# Altium project GNSS_MB.PrjPcb
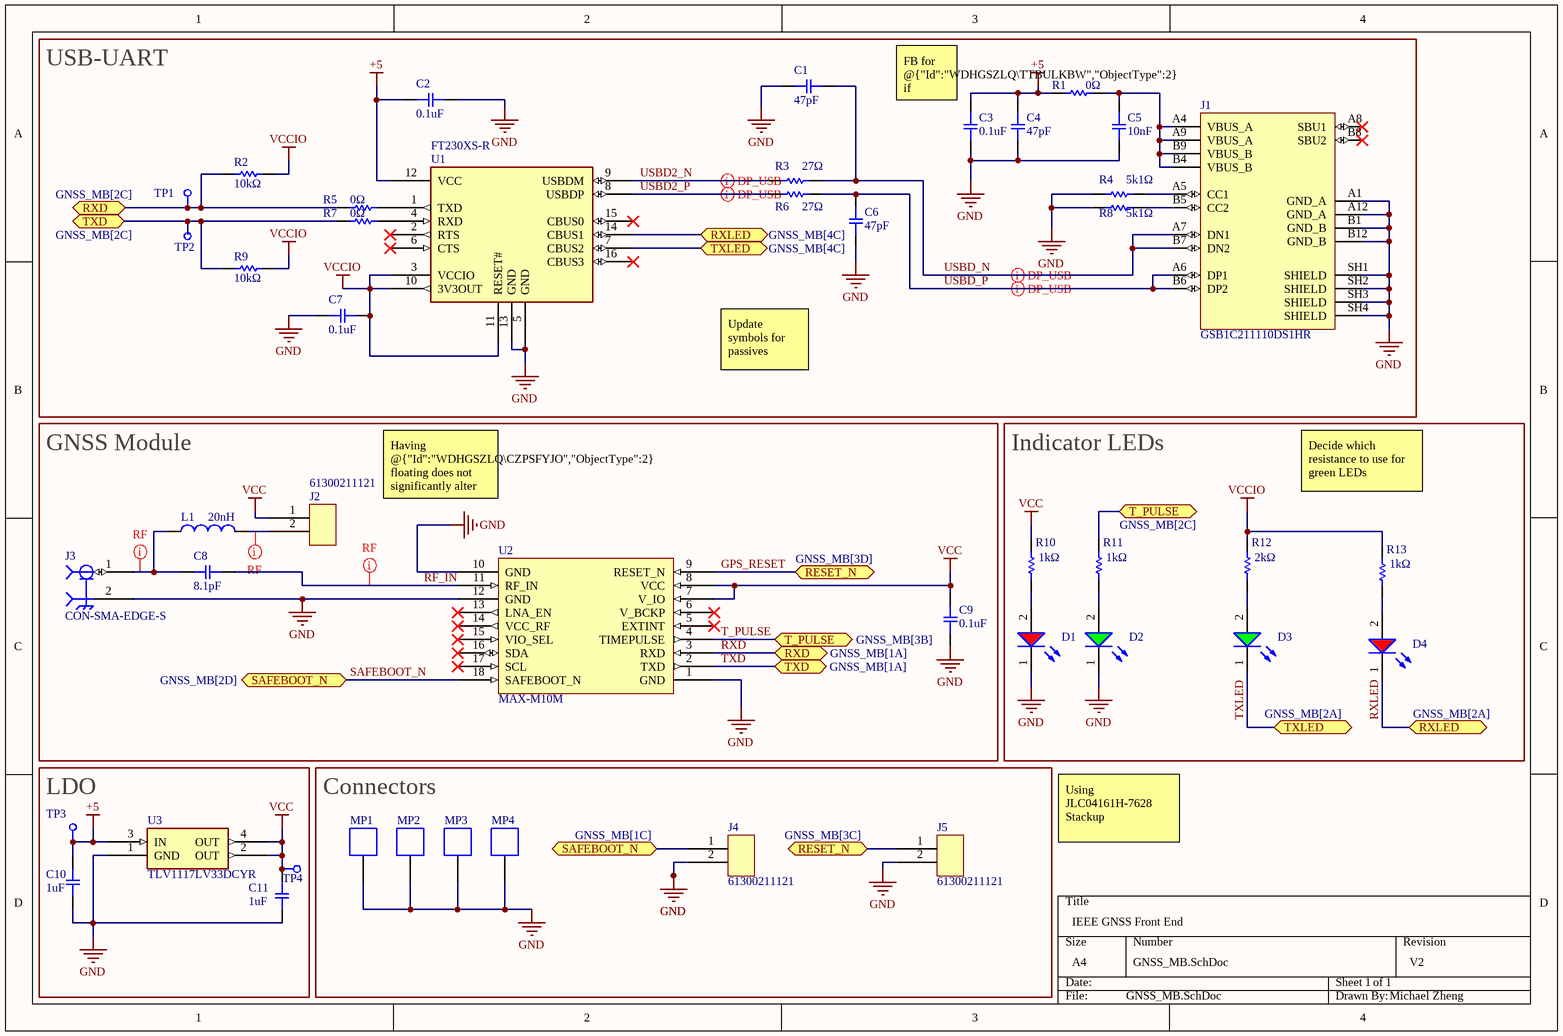
[diagram p0: GNSS_MB.SchDoc]
Author: Michael Zheng; Revision: V2; Title: IEEE GNSS Front End
1 sheet, 45 parts. Net scope: flat (ports and power ports of the same name join across sheets).
Board file: GNSS_MB.PcbDoc

## Sheet GNSS_MB.SchDoc: IEEE GNSS Front End
size A4; SheetNumber: 1; SheetTotal: 1

### Parts
C1  Capacitance: 47pF  [CAP_MURATA_0603]  (hidden comment: GCM1885C2A470JA16D)
C2  Capacitance: 0.1uF  [CAP_MURATA_0603]  (hidden comment: GCM188L81H104KA57D)
C3  Capacitance: 0.1uF  [CAP_MURATA_0603]  (hidden comment: GCM188L81H104KA57D)
C4  Capacitance: 47pF  [CAP_MURATA_0603]  (hidden comment: GCM1885C2A470JA16D)
C5  Capacitance: 10nF  [CAP_MURATA_0603]  (hidden comment: GCM188R72A103KA37D)
C6  Capacitance: 47pF  [CAP_MURATA_0603]  (hidden comment: GCM1885C2A470JA16D)
C7  Capacitance: 0.1uF  [CAP_MURATA_0603]  (hidden comment: GCM188L81H104KA57D)
C8  Capacitance: 8.1pF  [0402_CAP]  (hidden comment: GJM1555C1H8R1BB01D)
C9  Capacitance: 0.1uF  [CAP_MURATA_0603]  (hidden comment: GCM188L81H104KA57D)
C10  Capacitance: 1uF  [CAP_MURATA_0603]  (hidden comment: GRM188R61A105KA61D)
C11  Capacitance: 1uF  [CAP_MURATA_0603]  (hidden comment: GRM188R61A105KA61D)
D1  Red, 2V, 140°  [WL-SMCW]  (value not drawn)
D2  Green, 3.2V, 140°  [WL-SMCW]  (value not drawn)
D3  Green, 3.2V, 140°  [WL-SMCW]  (value not drawn)
D4  Red, 2V, 140°  [WL-SMCW]  (value not drawn)
J1  GSB1C211110DS1HR  [AMPHENOL_GSB1C211110DS1HR]
J2  61300211121  [61300211121]
J3  CON-SMA-EDGE-S  [RFSOLUTIONS_CON-SMA-EDGE-S]
J4  61300211121  [61300211121]
J5  61300211121  [61300211121]
L1  value 20nH  [INDC1006X60N]  (hidden comment: LQW15AN20NG8ZD)
MP1  36900000  [36900000]  (value not drawn)
MP2  36900000  [36900000]  (value not drawn)
MP3  36900000  [36900000]  (value not drawn)
MP4  36900000  [36900000]  (value not drawn)
R1  Resistance: 0Ω  [RC0603JR-070RL]  (hidden comment: RC0603JR-070RL)
R2  Resistance: 10kΩ  [RC0603JR-070RL]  (hidden comment: RC0603FR-0710KL)
R3  Resistance: 27Ω  [RC0603JR-070RL]  (hidden comment: RC0603FR-0727RL)
R4  Resistance: 5k1Ω  [RC0603JR-070RL]  (hidden comment: RC0603FR-075K1L)
R5  Resistance: 0Ω  [RC0603JR-070RL]  (hidden comment: RC0603JR-070RL)
R6  Resistance: 27Ω  [RC0603JR-070RL]  (hidden comment: RC0603FR-0727RL)
R7  Resistance: 0Ω  [RC0603JR-070RL]  (hidden comment: RC0603JR-070RL)
R8  Resistance: 5k1Ω  [RC0603JR-070RL]  (hidden comment: RC0603FR-075K1L)
R9  Resistance: 10kΩ  [RC0603JR-070RL]  (hidden comment: RC0603FR-0710KL)
R10  Resistance: 1kΩ  [RC0603JR-070RL]  (hidden comment: RC0603FR-071KL)
R11  Resistance: 1kΩ  [RC0603JR-070RL]  (hidden comment: RC0603FR-071KL)
R12  Resistance: 2kΩ  [RC0603JR-070RL]  (hidden comment: RC0603JR-072KL)
R13  Resistance: 1kΩ  [RC0603JR-070RL]  (hidden comment: RC0603FR-071KL)
TP1  TEST_POINT  [TEST_POINT]  (value not drawn)
TP2  TEST_POINT  [TEST_POINT]  (value not drawn)
TP3  TEST_POINT  [TEST_POINT]  (value not drawn)
TP4  TEST_POINT  [TEST_POINT]  (value not drawn)
U1  FT230XS-R  [FT230XS-R]
U2  MAX-M10M  [MAX-M10M]
U3  TLV1117LV33DCYR  [TLV1117LV33DCYR]

### Blocks framed on the sheet
USB-UART: C1-C7 J1 R1-R9 TP1 TP2 U1
GNSS Module: C8 C9 J2 J3 L1 U2
Indicator LEDs: D1-D4 R10-R13
LDO: C10 C11 TP3 TP4 U3
Connectors: J4 J5 MP1-MP4

### Ports
RESET_N (bidir, see GNSS_MB[3C]), RESET_N (bidir, see GNSS_MB[3D]), RXD (bidir, see GNSS_MB[1A]), RXD (bidir, see GNSS_MB[2C]), RXLED (bidir, see GNSS_MB[2A]), RXLED (bidir, see GNSS_MB[4C]), SAFEBOOT_N (bidir, see GNSS_MB[1C]), SAFEBOOT_N (bidir, see GNSS_MB[2D]), T_PULSE (bidir, see GNSS_MB[2C]), T_PULSE (bidir, see GNSS_MB[3B]), TXD (bidir, see GNSS_MB[1A]), TXD (bidir, see GNSS_MB[2C]), TXLED (bidir, see GNSS_MB[2A]), TXLED (bidir, see GNSS_MB[4C])

### Nets
+5: C2.2 C3.1 C4.1 C10.2 R1.1 TP3.1 U1.12(VCC) U3.3(IN)
GND: C1.1 C2.1 C3.2 C4.2 C5.2 C6.2 C7.2 C9.1 C10.1 C11.1 D1.1(K) D2.1(K) J1.A1(GND_A) J1.A12(GND_A) J1.B1(GND_B) J1.B12(GND_B) J1.SH1(SHIELD) J1.SH2(SHIELD) J1.SH3(SHIELD) J1.SH4(SHIELD) J3.2(GND) J4.2 J5.2 MP1.1 MP2.1 MP3.1 MP4.1 R4.1 R8.1 U1.5(GND) U1.13(GND) U2.1(GND) U2.10(GND) U2.12(GND) U3.1(GND)
VCC: C9.2 C11.2 J2.1 R10.2 TP4.1 U2.7(V_IO) U2.8(VCC) U3.2(OUT) U3.4(OUT)
VCCIO: C7.1 R2.2 R9.2 R12.2 R13.2 U1.3(VCCIO) U1.10(3V3OUT) U1.11(RESET#)
GPS_RESET: J5.1 U2.9(RESET_N) ; port RESET_N
RF_IN: C8.2 U2.11(RF_IN)
RXD: R2.1 R5.1 TP1.1 U2.3(RXD) ; port RXD
RXLED: D4.1(K) U1.14(CBUS1) ; port RXLED
SAFEBOOT_N: J4.1 U2.18(SAFEBOOT_N) ; port SAFEBOOT_N
T_PULSE: R11.2 U2.4(TIMEPULSE) ; port T_PULSE
TXD: R7.1 R9.1 TP2.1 U2.2(TXD) ; port TXD
TXLED: D3.1(K) U1.7(CBUS2) ; port TXLED
USBD2_N: R3.1 U1.9(USBDM)
USBD2_P: R6.1 U1.8(USBDP)
USBD_N: C1.2 J1.A7(DN1) J1.B7(DN2) R3.2
USBD_P: C6.1 J1.A6(DP1) J1.B6(DP2) R6.2
NetC5_1: C5.1 J1.A4(VBUS_A) J1.A9(VBUS_A) J1.B4(VBUS_B) J1.B9(VBUS_B) R1.2
NetC8_1: C8.1 J3.1(RF) L1.1
NetD1_2: D1.2(A) R10.1
NetD2_2: D2.2(A) R11.1
NetD3_2: D3.2(A) R12.1
NetD4_2: D4.2(A) R13.1
NetJ1_A5: J1.A5(CC1) R4.2
NetJ1_B5: J1.B5(CC2) R8.2
NetJ2_2: J2.2 L1.2
NetR5_2: R5.2 U1.1(TXD)
NetR7_2: R7.2 U1.4(RXD)

Not connected (* = marked no-connect by the designer): J1 A8(SBU1)* B8(SBU2)*; U1 2(RTS)* 6(CTS)* 15(CBUS0)* 16(CBUS3)*; U2 5(EXTINT)* 6(V_BCKP)* 13(LNA_EN)* 14(VCC_RF)* 15(VIO_SEL)* 16(SDA)* 17(SCL)*

### Layout directives
differential pair; differential pair class USB: USBD2_N, USBD2_P, USBD_N, USBD_P
net class RF: NetC8_1, NetJ2_2, RF_IN

### Notes on the sheet
- (near C3) FB for @{"Id":"WDHGSZLQ\TTBULKBW","ObjectType":2} if required
- Update symbols for passives
- Having @{"Id":"WDHGSZLQ\CZPSFYJO","ObjectType":2} floating does not significantly alter matching
- Decide which resistance to use for green LEDs
- Using JLC04161H-7628 Stackup

### Library data of the parts
C1 C4 C6 = GCM188L81H104KA57D: CAP CER 47PF 100V C0G/NP0 0603
C2 C3 C7 C9 = GCM188L81H104KA57D: CAP CER 0.1UF 50V X8L 0603
C5 = GCM188L81H104KA57D: CAP CER 10000PF 100V X7R 0603
C8 = GRM1555C1H102JA01D: CAP CER 8.1PF 50V C0G/NP0 0402
C10 C11 = GRM188R61A105KA61D: CAP CER 1UF 10V X5R 0603
D1 D4 = 150060RS75000: WL-SMCW Mono-color Chip LED Waterclear, SMT, size 0603, Red, 2V, 140°; Manufacturer: Wurth Elektronik; Case/Size Code: 0603; Chip Technology: AlInGaP; Dominant Wavelength: 625nm; Luminous Intensity: 250mcd; Peak Wavelength: 630nm; Manufacturer Part Number: 150060RS75000; Category: Signal LEDs; Match Code: WL-SMCW; ComponentLink1Description: Website Link; ComponentLink1URL: https://www.we-online.com/redexpert/article/150060RS75000?ad; ComponentLink2Description: Datasheet Link; ComponentLink2URL: https://www.we-online.com/redexpert/spec/150060RS75000?ad; Mount: Surface Mount; Operating Temperature Max: 85°C; Operating Temperature Min: -40°C; Packaging: Tape and Reel; Length: 1.6mm; Width: 0.8mm; Height: 0.7mm; Emitting Color: Red; Forward Voltage: 2V; Viewing Angle: 140°
D2 D3 = 150060GS75000: WL-SMCW Mono-color Chip LED Waterclear, SMT, size 0603, Green, 3.2V, 140°; Manufacturer: Wurth Elektronik; Case/Size Code: 0603; Chip Technology: InGaN; Dominant Wavelength: 525nm; Luminous Intensity: 430mcd; Peak Wavelength: 515nm; Manufacturer Part Number: 150060GS75000; Category: Signal LEDs; Match Code: WL-SMCW; ComponentLink1Description: Website Link; ComponentLink1URL: https://www.we-online.com/redexpert/article/150060GS75000?ad; ComponentLink2Description: Datasheet Link; ComponentLink2URL: https://www.we-online.com/redexpert/spec/150060GS75000?ad; Mount: Surface Mount; Operating Temperature Max: 85°C; Operating Temperature Min: -40°C; Packaging: Tape and Reel; Length: 1.6mm; Width: 0.8mm; Height: 0.7mm; Emitting Color: Green; Forward Voltage: 3.2V; Viewing Angle: 140°
J1 = GSB1C211110DS1HR: USB2.0, Type C, Top mount, Center Height 1.78mm, Dual Row DIP; MF: Amphenol Canada; SnapEDA_Link: https://www.snapeda.com/parts/GSB1C211110DS1HR/Amphenol/view-part/?ref=snap; Package: None; Value: *; MP: GSB1C211110DS1HR; Check_prices: https://www.snapeda.com/parts/GSB1C211110DS1HR/Amphenol/view-part/?ref=eda
J2 J4 J5 = 61300211121: CONN HEADER VERT 2POS 2.54MM
J3 = CON-SMA-EDGE-S: CONN SMA JACK STR EDGE MNT
L1 = LQW15AN3N6C10D: FIXED IND 20NH 800MA 0.186OHM SM; Package: None; Price: None; MP: LQW15AN3N6C10D; Availability: Unavailable
MP1-MP4 = 36900000: WE-SHC Shielding Cabinet, Clip, Tin Plated, Tape and Reel, 6.5x0.8x1.27mm; Manufacturer: Wurth Elektronik; Base Material: Steel; ComponentLink1Description: Website Link; ComponentLink1URL: https://www.we-online.com/redexpert/article/36900000?ad; ComponentLink2Description: Datasheet Link; ComponentLink2URL: https://www.we-online.com/redexpert/spec/36900000?ad; Manufacturer Part Number: 36900000; Category: EMC Shielding; Match Code: WE-SHC; Mount: Surface Mount; Operating Temperature Max: 125°C; Operating Temperature Min: -40°C; Packaging: Tape and Reel; Length: 6.5mm; Width: 0.8mm; Height: 1.27mm; Plating: Tin Plated; Type: Clip
R1 R5 R7 = RC0603JR-070RL: Chip Resistor, 0 Ohm, +/- 5%, 0.1 W, -55 to 155 degC, 0603 (1608 Metric), RoHS, Tape and Reel; Manufacturer: Yageo; Temperature Coefficient: 200ppm/degreesC; Voltage Rating: 50V; Power Rating: 100mW; Width: 0.8mm; Max Operating Temperature: 155degC; Tolerance: 5%; Package Reference: 0603; Height: 0.45mm; Depth: 0.8mm; Package Description: 2-Pin Surface Mount Device, Body 1.6 x 0.8 mm; Termination: SMD/SMT; Package Quantity: 5000; Case/Package: 0603; Case Code (Imperial): 0603; Radiation Hardening: No; Number of Pins: 2; Length: 1.6mm; Lead Free: LeadFree; Voltage Rating (DC): 50V; Military Standard: Not; Datasheet URL: http://www.yageo.com/NewPortal/yageodocoutput?fileName=/pdf/R-Chip/PYu-RC_Group_51_RoHS_L_5.pdf; Manufacturer URL: http://www.yageo.com/; Packaging: TapeandReel; Case Code (Metric): 1608; Min Operating Temperature: -55degC; Composition: ThickFilm; RoHSCompliant: true; Contact Plating: Tin; Datasheet Version: Rev. 5, 10/2016; REACH SVHC: NoSVHC
R2 R9 = RC0603JR-070RL: RES 10K OHM 1% 1/10W 0603; Manufacturer: Yageo; Temperature Coefficient: 200ppm/degreesC; Tolerance: 5%; Voltage Rating: 50V; Power Rating: 100mW; Width: 0.8mm; Max Operating Temperature: 155degC; Package Reference: 0603; Height: 0.45mm; Depth: 0.8mm; Package Description: 2-Pin Surface Mount Device, Body 1.6 x 0.8 mm; Termination: SMD/SMT; Package Quantity: 5000; Case/Package: 0603; Case Code (Imperial): 0603; Radiation Hardening: No; Number of Pins: 2; Length: 1.6mm; Lead Free: LeadFree; Voltage Rating (DC): 50V; Military Standard: Not; Datasheet URL: http://www.yageo.com/NewPortal/yageodocoutput?fileName=/pdf/R-Chip/PYu-RC_Group_51_RoHS_L_5.pdf; Manufacturer URL: http://www.yageo.com/; Packaging: TapeandReel; Case Code (Metric): 1608; Min Operating Temperature: -55degC; Composition: ThickFilm; RoHSCompliant: true; Contact Plating: Tin; Datasheet Version: Rev. 5, 10/2016; REACH SVHC: NoSVHC
R3 R6 = RC0603JR-070RL: RES 27 OHM 1% 1/10W 0603; Manufacturer: Yageo; Temperature Coefficient: 200ppm/degreesC; Tolerance: 5%; Voltage Rating: 50V; Power Rating: 100mW; Width: 0.8mm; Max Operating Temperature: 155degC; Package Reference: 0603; Height: 0.45mm; Depth: 0.8mm; Package Description: 2-Pin Surface Mount Device, Body 1.6 x 0.8 mm; Termination: SMD/SMT; Package Quantity: 5000; Case/Package: 0603; Case Code (Imperial): 0603; Radiation Hardening: No; Number of Pins: 2; Length: 1.6mm; Lead Free: LeadFree; Voltage Rating (DC): 50V; Military Standard: Not; Datasheet URL: http://www.yageo.com/NewPortal/yageodocoutput?fileName=/pdf/R-Chip/PYu-RC_Group_51_RoHS_L_5.pdf; Manufacturer URL: http://www.yageo.com/; Packaging: TapeandReel; Case Code (Metric): 1608; Min Operating Temperature: -55degC; Composition: ThickFilm; RoHSCompliant: true; Contact Plating: Tin; Datasheet Version: Rev. 5, 10/2016; REACH SVHC: NoSVHC
R4 R8 = RC0603JR-070RL: RES 5.1K OHM 1% 1/10W 0603; Manufacturer: Yageo; Temperature Coefficient: 200ppm/degreesC; Tolerance: 5%; Voltage Rating: 50V; Power Rating: 100mW; Width: 0.8mm; Max Operating Temperature: 155degC; Package Reference: 0603; Height: 0.45mm; Depth: 0.8mm; Package Description: 2-Pin Surface Mount Device, Body 1.6 x 0.8 mm; Termination: SMD/SMT; Package Quantity: 5000; Case/Package: 0603; Case Code (Imperial): 0603; Radiation Hardening: No; Number of Pins: 2; Length: 1.6mm; Lead Free: LeadFree; Voltage Rating (DC): 50V; Military Standard: Not; Datasheet URL: http://www.yageo.com/NewPortal/yageodocoutput?fileName=/pdf/R-Chip/PYu-RC_Group_51_RoHS_L_5.pdf; Manufacturer URL: http://www.yageo.com/; Packaging: TapeandReel; Case Code (Metric): 1608; Min Operating Temperature: -55degC; Composition: ThickFilm; RoHSCompliant: true; Contact Plating: Tin; Datasheet Version: Rev. 5, 10/2016; REACH SVHC: NoSVHC
R10 R11 R13 = RC0603JR-070RL: 1 kOhms ±1% 0.1W, 1/10W Chip Resistor 0603 (1608 Metric) Moisture Resistant Thick Film; Manufacturer: Yageo; Temperature Coefficient: 200ppm/degreesC; Tolerance: 5%; Voltage Rating: 50V; Power Rating: 100mW; Width: 0.8mm; Max Operating Temperature: 155degC; Package Reference: 0603; Height: 0.45mm; Depth: 0.8mm; Package Description: 2-Pin Surface Mount Device, Body 1.6 x 0.8 mm; Termination: SMD/SMT; Package Quantity: 5000; Case/Package: 0603; Case Code (Imperial): 0603; Radiation Hardening: No; Number of Pins: 2; Length: 1.6mm; Lead Free: LeadFree; Voltage Rating (DC): 50V; Military Standard: Not; Datasheet URL: http://www.yageo.com/NewPortal/yageodocoutput?fileName=/pdf/R-Chip/PYu-RC_Group_51_RoHS_L_5.pdf; Manufacturer URL: http://www.yageo.com/; Packaging: TapeandReel; Case Code (Metric): 1608; Min Operating Temperature: -55degC; Composition: ThickFilm; RoHSCompliant: true; Contact Plating: Tin; Datasheet Version: Rev. 5, 10/2016; REACH SVHC: NoSVHC
R12 = RC0603JR-070RL: 2 kOhms ±5% 0.1W, 1/10W Chip Resistor 0603 (1608 Metric) Moisture Resistant Thick Film; Manufacturer: Yageo; Temperature Coefficient: 200ppm/degreesC; Voltage Rating: 50V; Power Rating: 100mW; Width: 0.8mm; Max Operating Temperature: 155degC; Tolerance: 5%; Package Reference: 0603; Height: 0.45mm; Depth: 0.8mm; Package Description: 2-Pin Surface Mount Device, Body 1.6 x 0.8 mm; Termination: SMD/SMT; Package Quantity: 5000; Case/Package: 0603; Case Code (Imperial): 0603; Radiation Hardening: No; Number of Pins: 2; Length: 1.6mm; Lead Free: LeadFree; Voltage Rating (DC): 50V; Military Standard: Not; Datasheet URL: http://www.yageo.com/NewPortal/yageodocoutput?fileName=/pdf/R-Chip/PYu-RC_Group_51_RoHS_L_5.pdf; Manufacturer URL: http://www.yageo.com/; Packaging: TapeandReel; Case Code (Metric): 1608; Min Operating Temperature: -55degC; Composition: ThickFilm; RoHSCompliant: true; Contact Plating: Tin; Datasheet Version: Rev. 5, 10/2016; REACH SVHC: NoSVHC
TP1-TP4 = TEST_POINT: TEST POINT 2MM
U1 = FT230XS-R: USB FULL SPEED TO SERIAL UART IC
U2 = MAX-M10M: GNSS LCC RX MOD, ROM, CRYSTAL
U3 = TLV1117LV33DCYR: IC REG LINEAR 3.3V 1A SOT223-4

## Assembly variants
Variant of GNSS_MB: not fitted J4 J5 TP1 TP2 TP3 TP4